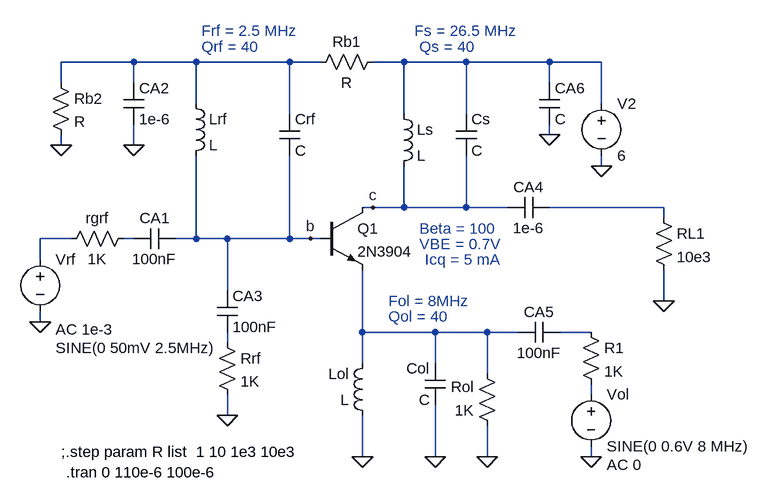
[diagram p0: schematic mixer_b.asc]
mixer_b.asc, the LTspice schematic file:
Version 4
SHEET 1 880 680
WIRE -304 -112 -416 -112
WIRE -208 -112 -304 -112
WIRE -64 -112 -208 -112
WIRE -16 -112 -64 -112
WIRE 112 -112 64 -112
WIRE 208 -112 112 -112
WIRE 336 -112 208 -112
WIRE 416 -112 336 -112
WIRE -416 -80 -416 -112
WIRE -304 -80 -304 -112
WIRE 336 -80 336 -112
WIRE -208 -48 -208 -112
WIRE 416 -48 416 -112
WIRE -64 -32 -64 -112
WIRE 112 -32 112 -112
WIRE 208 -32 208 -112
WIRE 336 0 336 -16
WIRE -416 16 -416 0
WIRE -304 16 -304 -16
WIRE 416 48 416 32
WIRE 64 112 48 112
WIRE 112 112 112 48
WIRE 112 112 64 112
WIRE 208 112 208 32
WIRE 208 112 112 112
WIRE 272 112 208 112
WIRE 512 112 336 112
WIRE 512 128 512 112
WIRE -400 160 -448 160
WIRE -304 160 -320 160
WIRE -208 160 -208 32
WIRE -208 160 -240 160
WIRE -160 160 -208 160
WIRE -64 160 -64 32
WIRE -64 160 -160 160
WIRE -32 160 -64 160
WIRE -16 160 -32 160
WIRE -448 192 -448 160
WIRE -160 240 -160 160
WIRE 512 256 512 208
WIRE -448 288 -448 272
WIRE 48 304 48 208
WIRE 160 304 48 304
WIRE 240 304 160 304
WIRE 288 304 240 304
WIRE 400 304 352 304
WIRE -160 320 -160 304
WIRE 48 352 48 304
WIRE 160 352 160 304
WIRE 240 368 240 304
WIRE 400 400 400 384
WIRE -160 432 -160 400
WIRE 48 496 48 432
WIRE 160 496 160 416
WIRE 240 496 240 448
WIRE 400 496 400 480
FLAG 416 48 0
FLAG 400 496 0
FLAG -448 288 0
FLAG -304 16 0
FLAG -32 160 b
FLAG 64 112 c
FLAG -160 432 0
FLAG 512 256 0
FLAG 48 496 0
FLAG 160 496 0
FLAG 240 496 0
FLAG -416 16 0
FLAG 336 0 0
SYMBOL npn -16 112 R0
SYMATTR InstName Q1
SYMATTR Value 2N3904
SYMBOL ind -224 -64 R0
SYMATTR InstName Lrf
SYMBOL ind 64 448 R180
WINDOW 0 36 80 Left 2
WINDOW 3 36 40 Left 2
SYMATTR InstName Lol
SYMBOL cap -240 144 R90
WINDOW 0 0 32 VBottom 2
WINDOW 3 32 32 VTop 2
SYMATTR InstName CA1
SYMATTR Value 100nF
SYMBOL cap 176 416 R180
WINDOW 0 24 56 Left 2
WINDOW 3 24 8 Left 2
SYMATTR InstName Col
SYMBOL voltage 416 -64 R0
WINDOW 123 0 0 Left 0
WINDOW 39 0 0 Left 0
SYMATTR InstName V2
SYMATTR Value 6
SYMBOL voltage -448 176 R0
WINDOW 3 24 152 Left 2
WINDOW 123 24 124 Left 2
WINDOW 39 0 0 Left 0
SYMATTR Value SINE(0 50mV 2.5MHz)
SYMATTR Value2 AC 1e-3
SYMATTR InstName Vrf
SYMBOL cap -320 -80 R0
SYMATTR InstName CA2
SYMATTR Value 1e-6
SYMBOL cap -176 240 R0
SYMATTR InstName CA3
SYMATTR Value 100nF
SYMBOL res -176 304 R0
SYMATTR InstName Rrf
SYMATTR Value 1K
SYMBOL voltage 400 384 R0
WINDOW 123 24 124 Left 2
WINDOW 39 0 0 Left 0
SYMATTR Value2 AC 0
SYMATTR InstName Vol
SYMATTR Value SINE(0 0.6V 8 MHz)
SYMBOL cap -80 -32 R0
SYMATTR InstName Crf
SYMBOL cap 336 96 R90
WINDOW 0 0 32 VBottom 2
WINDOW 3 32 32 VTop 2
SYMATTR InstName CA4
SYMATTR Value 1e-6
SYMBOL res 496 112 R0
SYMATTR InstName RL1
SYMATTR Value 10e3
SYMBOL ind 96 -48 R0
SYMATTR InstName Ls
SYMBOL cap 192 -32 R0
SYMATTR InstName Cs
SYMBOL cap 352 288 R90
WINDOW 0 0 32 VBottom 2
WINDOW 3 32 32 VTop 2
SYMATTR InstName CA5
SYMATTR Value 100nF
SYMBOL res 256 464 R180
WINDOW 0 36 76 Left 2
WINDOW 3 36 40 Left 2
SYMATTR InstName Rol
SYMATTR Value 1K
SYMBOL res -432 -96 R0
SYMATTR InstName Rb2
SYMBOL res 80 -128 R90
WINDOW 0 0 56 VBottom 2
WINDOW 3 32 56 VTop 2
SYMATTR InstName Rb1
SYMBOL cap 320 -80 R0
SYMATTR InstName CA6
SYMBOL res -304 144 R90
WINDOW 0 0 56 VBottom 2
WINDOW 3 32 56 VTop 2
SYMATTR InstName rgrf
SYMATTR Value 1K
SYMBOL res 384 288 R0
SYMATTR InstName R1
SYMATTR Value 1K
TEXT -408 520 Left 2 !.tran 0 110e-6 100e-6
TEXT -416 488 Left 2 !;.step param R list  1 10 1e3 10e3
TEXT 128 -160 Left 2 ;Fs = 26.5 MHz
TEXT 88 256 Left 2 ;Fol = 8MHz
TEXT 136 144 Left 2 ;Beta = 100
TEXT 136 168 Left 2 ;VBE = 0.7V
TEXT 144 192 Left 2 ;Icq = 5 mA
TEXT -200 -160 Left 2 ;Frf = 2.5 MHz
TEXT -200 -136 Left 2 ;Qrf = 40
TEXT 88 280 Left 2 ;Qol = 40
TEXT 136 -136 Left 2 ;Qs = 40

The netlist it stands for:
* mixer_b.asc
Q1 c b N006 0 2N3904
Lrf N001 b L
Lol 0 N006 L
CA1 b N005 100nF
Col 0 N006 C
V2 N002 0 6
Vrf N004 0 SINE(0 50mV 2.5MHz) AC 1e-3
CA2 N001 0 1e-6
CA3 b N008 100nF
Rrf N008 0 1K
Vol N009 0 SINE(0 0.6V 8 MHz) AC 0
Crf N001 b C
CA4 N003 c 1e-6
RL1 N003 0 10e3
Ls N002 c L
Cs N002 c C
CA5 N007 N006 100nF
Rol 0 N006 1K
Rb2 N001 0 R
Rb1 N002 N001 R
CA6 N002 0 C
rgrf N005 N004 1K
R1 N007 N009 1K
.model NPN NPN
.model PNP PNP
.lib standard.bjt
.tran 0 110e-6 100e-6
;.step param R list  1 10 1e3 10e3
* Fs = 26.5 MHz
* Fol = 8MHz
* Beta = 100
* VBE = 0.7V
* Icq = 5 mA
* Frf = 2.5 MHz
* Qrf = 40
* Qol = 40
* Qs = 40
.backanno
.end